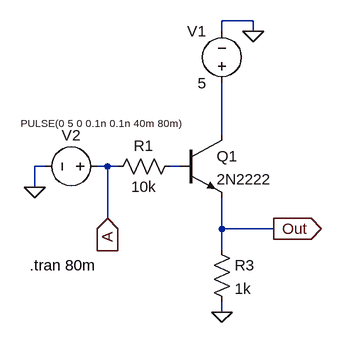
[diagram p0: schematic buff.asc]
buff.asc, the LTspice schematic file:
Version 4
SHEET 1 1080 680
WIRE 400 -144 352 -144
WIRE 352 -128 352 -144
WIRE 400 -128 400 -144
WIRE 352 32 352 -48
WIRE 80 80 64 80
WIRE 176 80 160 80
WIRE 192 80 176 80
WIRE 288 80 272 80
WIRE 64 112 64 80
WIRE 176 160 176 80
WIRE 352 176 352 128
WIRE 432 176 352 176
WIRE 352 208 352 176
WIRE 352 304 352 288
FLAG 352 304 0
FLAG 400 -128 0
FLAG 64 112 0
FLAG 432 176 Out
IOPIN 432 176 Out
FLAG 176 160 A
IOPIN 176 160 In
SYMBOL npn 288 32 R0
SYMATTR InstName Q1
SYMATTR Value 2N2222
SYMBOL voltage 352 -32 R180
WINDOW 0 24 96 Left 2
WINDOW 3 24 16 Left 2
WINDOW 123 0 0 Left 0
WINDOW 39 0 0 Left 0
SYMATTR InstName V1
SYMATTR Value 5
SYMBOL res 288 64 R90
WINDOW 0 0 56 VBottom 2
WINDOW 3 32 56 VTop 2
SYMATTR InstName R1
SYMATTR Value 10k
SYMBOL voltage 176 80 R90
WINDOW 0 -32 56 VBottom 2
WINDOW 3 -77 12 VTop 1
WINDOW 123 0 0 Left 0
WINDOW 39 0 0 Left 0
SYMATTR InstName V2
SYMATTR Value PULSE(0 5 0 0.1n 0.1n 40m 80m)
SYMBOL res 336 192 R0
SYMATTR InstName R3
SYMATTR Value 1k
TEXT 56 232 Left 2 !.tran 80m

The netlist it stands for:
* buff.asc
Q1 N001 N002 Out 0 2N2222
V1 N001 0 5
R1 N002 A 10k
V2 A 0 PULSE(0 5 0 0.1n 0.1n 40m 80m)
R3 Out 0 1k
.model NPN NPN
.model PNP PNP
.lib standard.bjt
.tran 80m
.backanno
.end

* Results of the author's LTspice run, read from the files saved beside the schematic
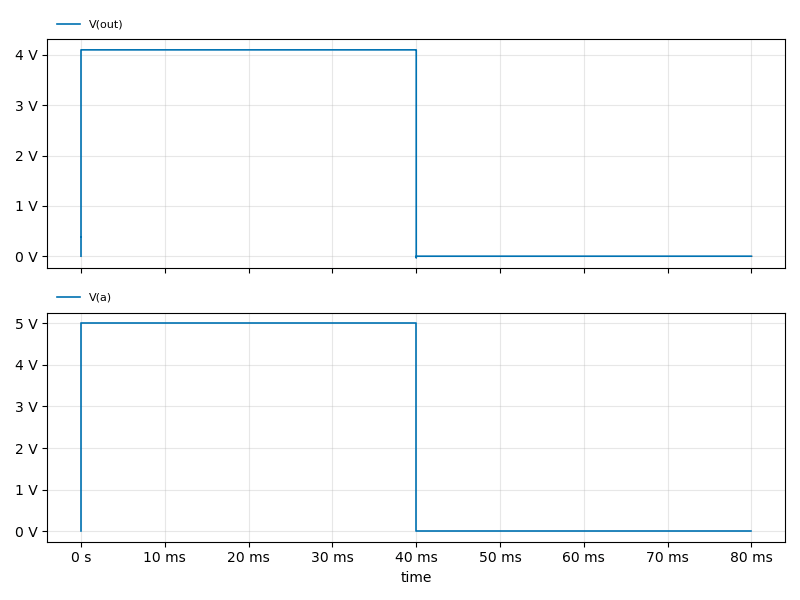
[diagram p1: Transient Analysis of buff.asc, plotted from the saved traces]
* Transient Analysis, 1 run:
*   V(out): min -36.27 mV, max 4.101 V, average 2.05 V, rms 2.9 V, last 0 V
*   V(a): min 0 V, max 5 V, average 2.5 V, rms 3.536 V, last 0 V